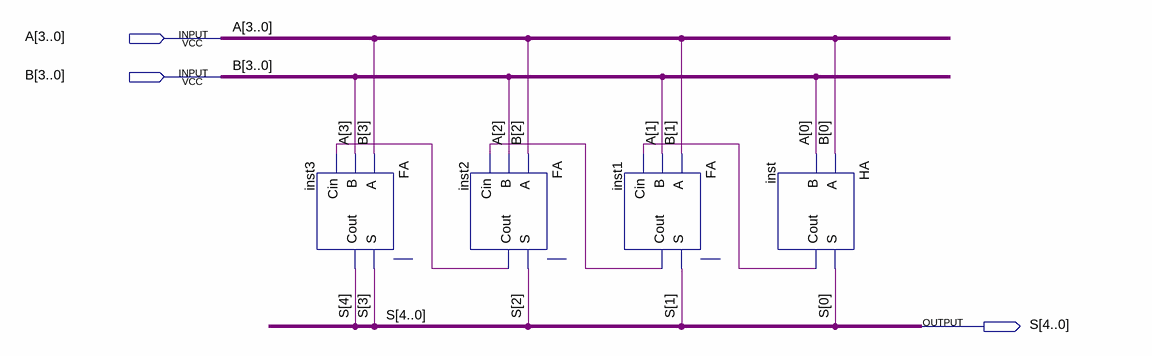
[diagram p0: schematic sheet]
// Quartus schematic CONG4BIT.bdf as structural Verilog: 4 symbols, 3 pins
module CONG4BIT (
  input  [3:0] A,
  input  [3:0] B,
  output [4:0] S
);

  wire inst1_cout, inst2_cout, inst_cout;

  FA inst3 (.A(B[3]), .B(A[3]), .Cin(inst2_cout), .S(S[3]), .Cout(S[4]));  // open: port
  FA inst2 (.A(B[2]), .B(A[2]), .Cin(inst1_cout), .S(S[2]), .Cout(inst2_cout));  // open: port
  FA inst1 (.A(B[1]), .B(A[1]), .Cin(inst_cout), .S(S[1]), .Cout(inst1_cout));  // open: port
  HA inst (.A(B[0]), .B(A[0]), .S(S[0]), .Cout(inst_cout));
endmodule
